# EasyEDA Pro project ProDocument_N64 SpyDVI QSB_2024-08-22.epro

# Schematic QSB
Board Name: N64 SpyDVI QSB; Create Date: 2024-08-20; Page Name: Schematic; Project Name: SpyDVI-QSB; Schematic Name: QSB; Update Date: 2024-08-22; Add into BOM: yes; Company: Chobrenga; Convert to PCB: yes; Date: 2024-08-22; Draw By: Chobrenga; REV: 1.1; Sheet: 1/1
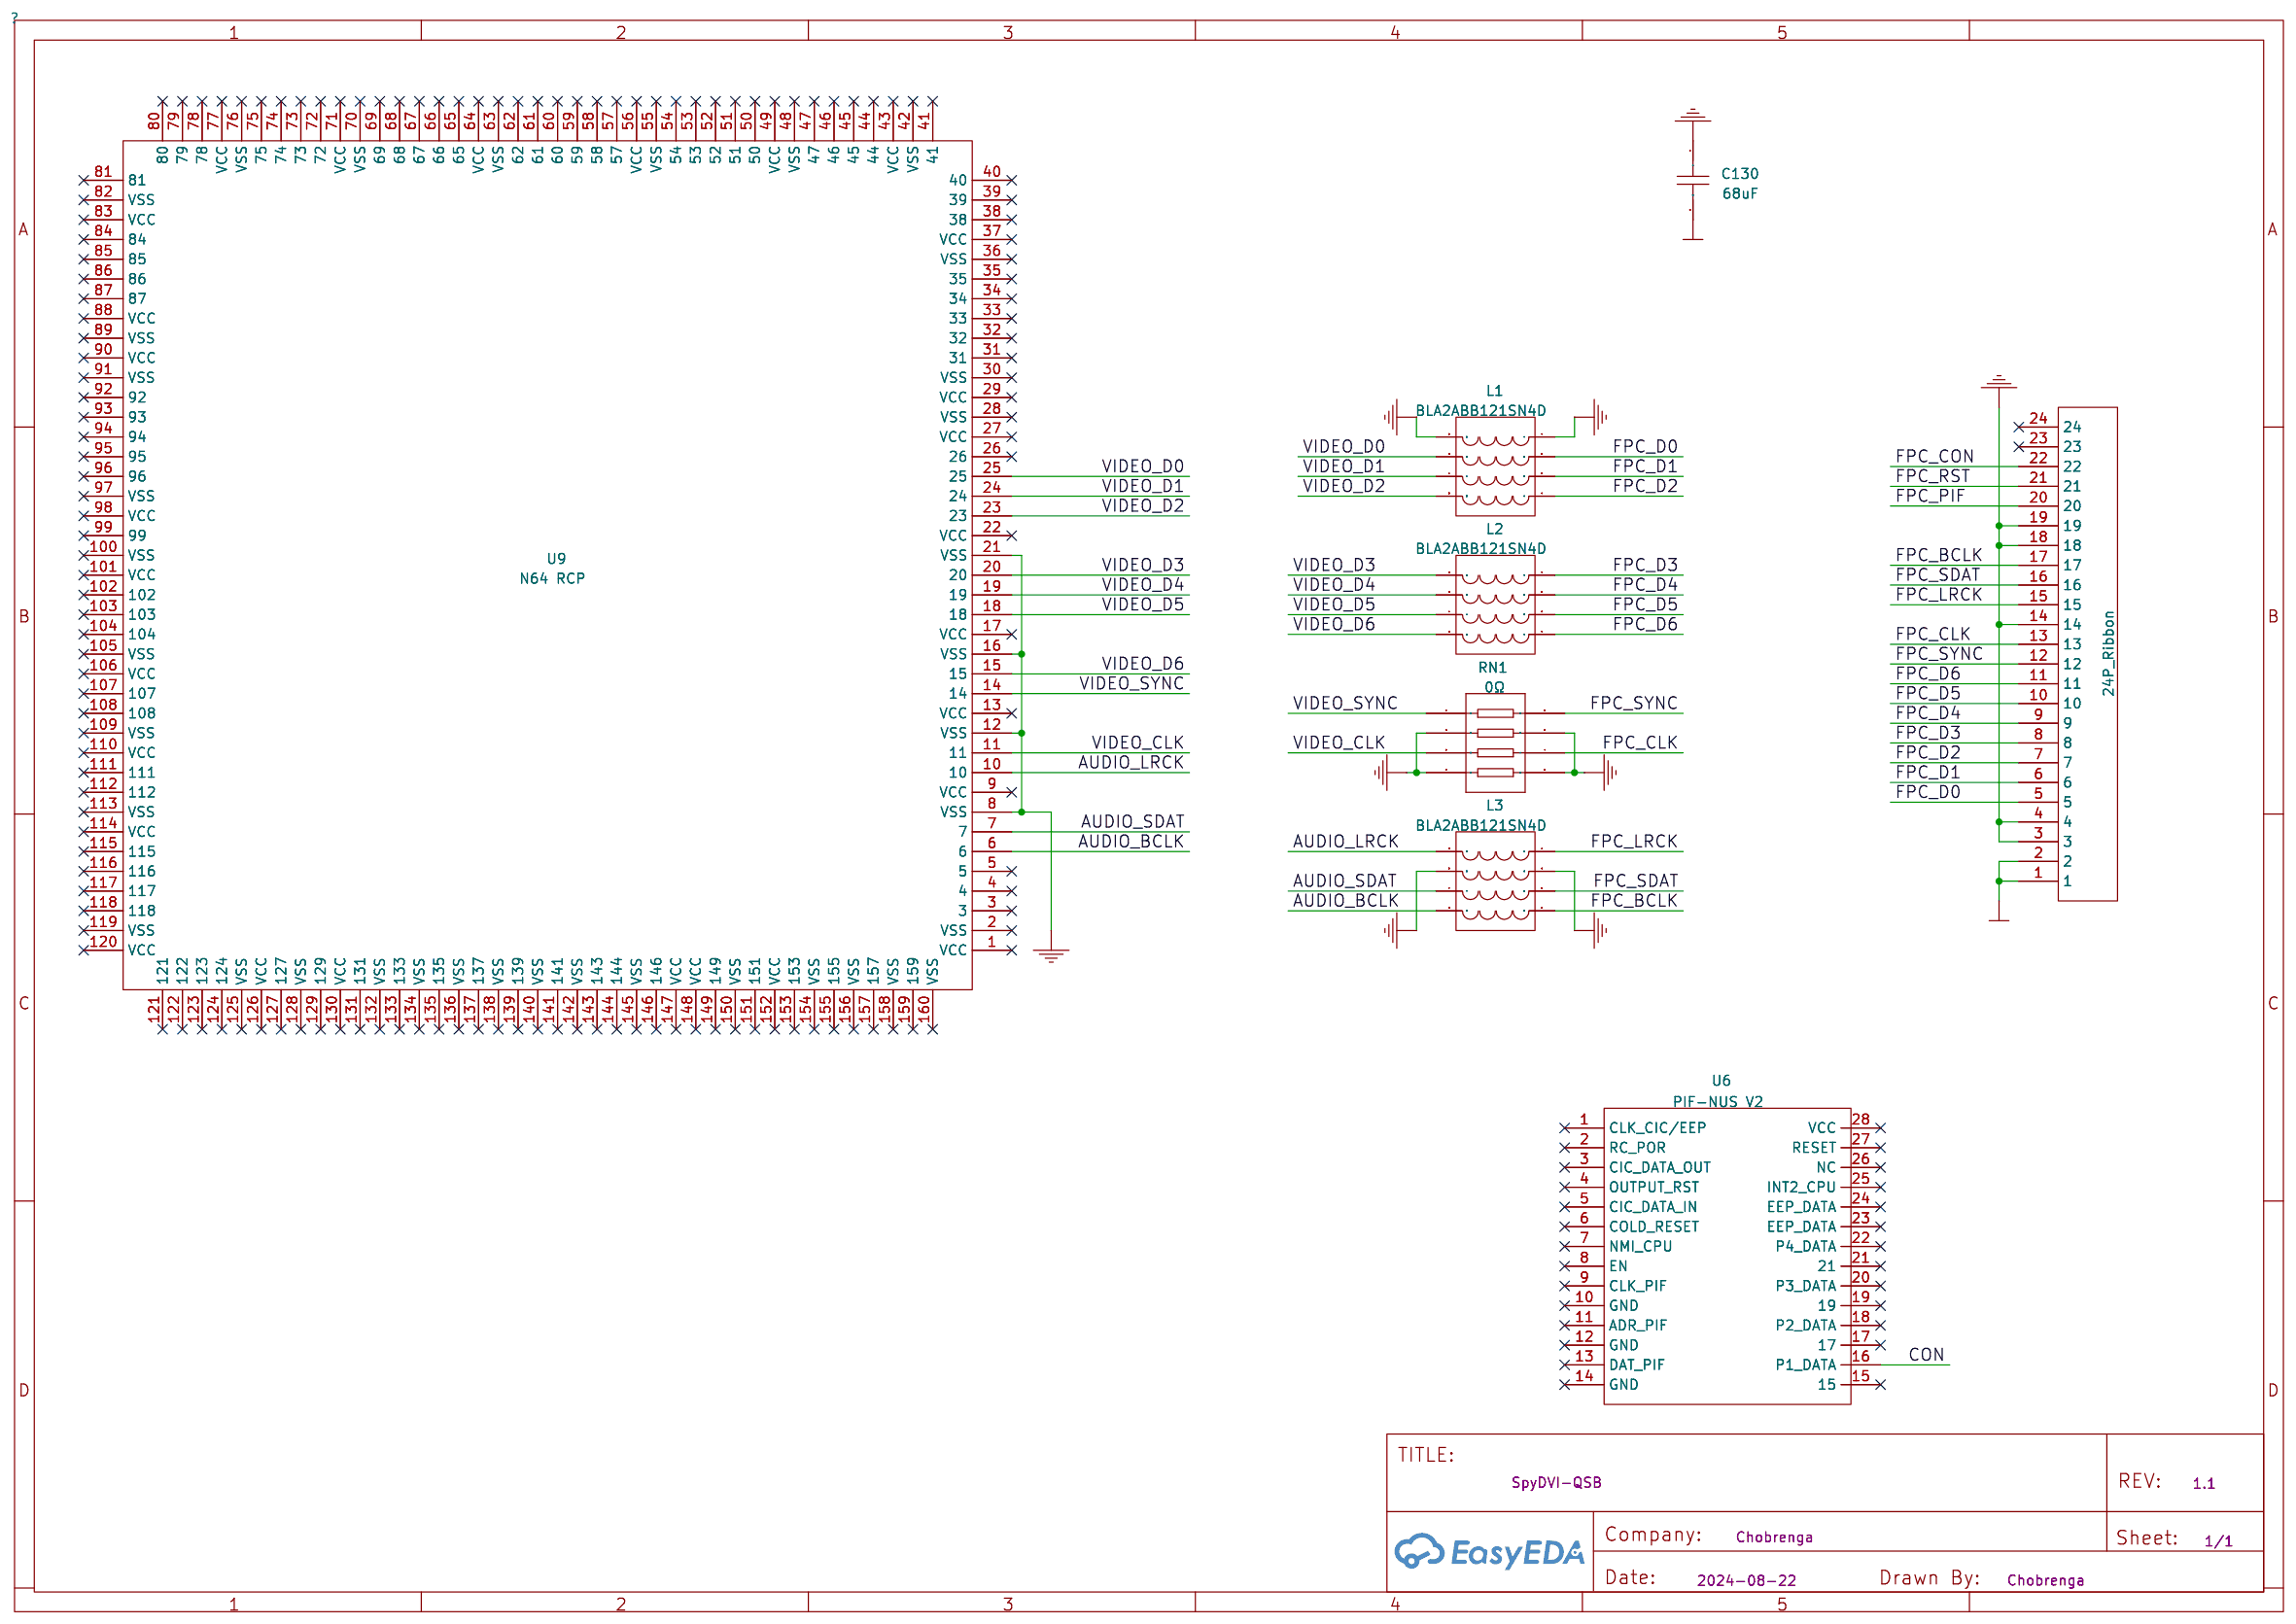
[diagram p0: schematic sheet]

## Parts
C130  68uF  (no BOM)
L1  BLA2ABB121SN4D  [BEAD-SMD_8P-L2.0-W1.0-P0.50-TL]
L2  BLA2ABB121SN4D  [BEAD-SMD_8P-L2.0-W1.0-P0.50-TL]
L3  BLA2ABB121SN4D  [BEAD-SMD_8P-L2.0-W1.0-P0.50-TL]
RN1  0Ω  [RES-ARRAY-SMD_0402-8P-L2.0-W1.0-BL]
U1  24P_Ribbon  [24P_FFC]  (no BOM)
U6  PIF-NUS V2  (no BOM)
U9  N64 RCP  [RCP NUS]  (no BOM)

## Library data of the parts
C130 = 68uF
L1-L3 = BLA2ABB121SN4D: Supplier: LCSC; Supplier Part: C440126; Manufacturer: muRata(村田); JLCPCB Part Class: Extended Part
RN1 = 0Ω: Supplier: LCSC; Manufacturer: FH(风华); Manufacturer Part: RC-MT08W000JT; Supplier Part: C2001; JLCPCB Part Class: Extended Part
U1 = 24P_Ribbon
U6 = PIF-NUS V2
U9 = N64 RCP

## Nets
+5V: C130.2 U1.1 U1.2
GND: C130.1 L1.4 L1.5 L3.3 L3.6 RN1.1 RN1.3 RN1.6 RN1.8 U1.3 U1.4 U1.14 U1.18 U1.19 U9.8(VSS) U9.12(VSS) U9.16(VSS) U9.21(VSS)
AUDIO_BCLK: L3.8 U9.6
AUDIO_LRCK: L3.5 U9.10
AUDIO_SDAT: L3.7 U9.7
CON: U6.16(P1 DATA)
FPC_BCLK: L3.1 U1.17
FPC_CLK: RN1.7 U1.13
FPC_CON: U1.22
FPC_D0: L1.3 U1.5
FPC_D1: L1.2 U1.6
FPC_D2: L1.1 U1.7
FPC_D3: L2.4 U1.8
FPC_D4: L2.3 U1.9
FPC_D5: L2.2 U1.10
FPC_D6: L2.1 U1.11
FPC_LRCK: L3.4 U1.15
FPC_PIF: U1.20
FPC_RST: U1.21
FPC_SDAT: L3.2 U1.16
FPC_SYNC: RN1.5 U1.12
VIDEO_CLK: RN1.2 U9.11
VIDEO_D0: L1.6 U9.25
VIDEO_D1: L1.7 U9.24
VIDEO_D2: L1.8 U9.23
VIDEO_D3: L2.5 U9.20
VIDEO_D4: L2.6 U9.19
VIDEO_D5: L2.7 U9.18
VIDEO_D6: L2.8 U9.15
VIDEO_SYNC: RN1.4 U9.14

Not connected (* = marked no-connect by the designer): U1 23* 24*; U6 1(CLK CIC/EEP)* 2(RC POR)* 3(CIC DATA OUT)* 4(OUTPUT RST)* 5(CIC DATA IN)* 6(COLD RESET)* 7(NMI_CPU)* 8(EN)* 9(CLK PIF)* 10(GND)* 11(ADR PIF)* 12(GND)* 13(DAT PIF)* 14(GND)* 15* 17* 18(P2 DATA)* 19* 20(P3 DATA)* 21* 22(P4 DATA)* 23(EEP DATA)* 24(EEP DATA)* 25(INT2 CPU)* 26(NC)* 27(RESET)* 28(VCC)*; U9 1(VCC)* 2(VSS)* 3* 4* 5* 9(VCC)* 13(VCC)* 17(VCC)* 22(VCC)* 26* 27(VCC)* 28(VSS)* 29(VCC)* 30(VSS)* 31* 32* 33* 34* 35* 36(VSS)* 37(VCC)* 38* 39* 40* 41* 42(VSS)* 43(VCC)* 44* 45* 46* 47* 48(VSS)* 49(VCC)* 50* 51* 52* 53* 54* 55(VSS)* 56(VCC)* 57* 58* 59* 60* 61* 62* 63(VSS)* 64(VCC)* 65* 66* 67* 68* 69* 70(VSS)* 71(VCC)* 72* 73* 74* 75* 76(VSS)* 77(VCC)* 78* 79* 80* 81* 82(VSS)* 83(VCC)* 84* 85* 86* 87* 88(VCC)* 89(VSS)* 90(VCC)* 91(VSS)* 92* 93* 94* 95* 96* 97(VSS)* 98(VCC)* 99* 100(VSS)* 101(VCC)* 102* 103* 104* 105(VSS)* 106(VCC)* 107* 108* 109(VSS)* 110(VCC)* 111* 112* 113(VSS)* 114(VCC)* 115* 116* 117* 118* 119(VSS)* 120(VCC)* 121* 122* 123* 124* 125(VSS)* 126(VCC)* 127* 128(VSS)* 129* 130(VCC)* 131* 132(VSS)* 133* 134(VSS)* 135* 136(VSS)* 137* 138(VSS)* 139* 140(VSS)* 141* 142(VSS)* 143* 144* 145(VSS)* 146* 147(VCC)* 148(VCC)* 149* 150(VSS)* 151* 152(VCC)* 153* 154(VSS)* 155* 156(VSS)* 157* 158(VSS)* 159* 160(VSS)*

# Board 1-PCB_PCB_N64 SpyDVI QSB
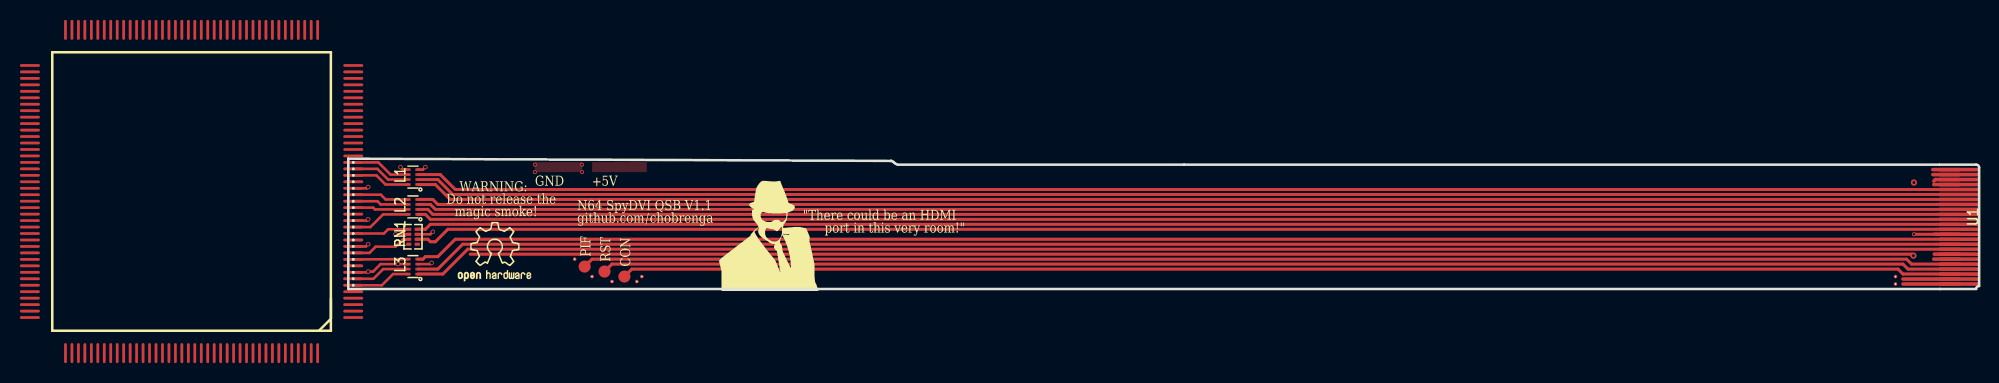
[diagram p1: board, top side]
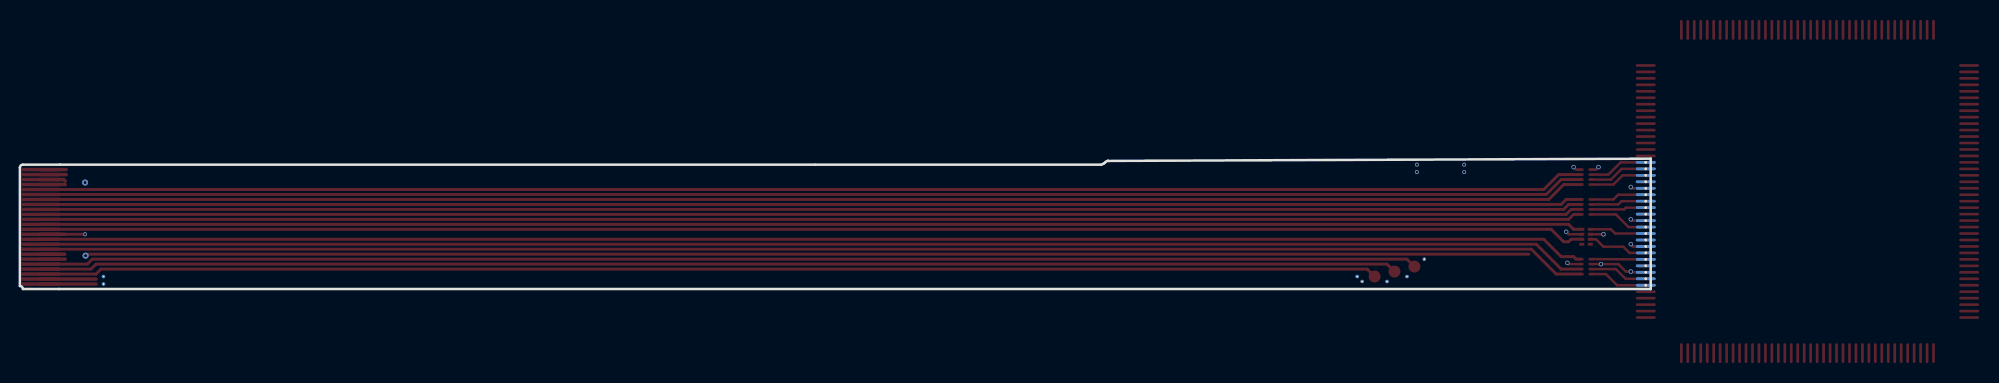
[diagram p2: board, bottom side, seen from below]

Outline 163.9 x 13.1 mm; copper layers: Top Layer, Bottom Layer. Coordinates in mm from the lower left corner of the outline.
Outline path: 159.9,12.5 84,12.5 55.24,12.5 arc(55.09,12.54) 54.96,12.62 54.84,12.72 arc(54.72,12.83) 54.56,12.88 54.55,12.88 0,13.1 0,0 160,0
Stack: Top Layer 0.012mm / Dielectric1 0.025mm FR4 er 4.5 / Bottom Layer 0.012mm

## Design rules (mm)
template: User Custom Config
spacing Default (default): track to track 0.13, other pairs 0 to 0.13
track width Default (default): min 0.254, default 0.254, max 25.4
differential pair differentialPair (default): width min 0.127, default 0.254, max 2.54; gap min 0.152, default 0.152
via Default (default): diameter min 0.35, default 0.35, max 100.025; hole min 0.15, default 0.15, max 59.995
pour e1 uses Default
pour e146 uses gge5972
pour e145 uses Default

## Placement (name value [footprint] x y rotation side)
L1  BLA2ABB121SN4D  [BEAD-SMD_8P-L2.0-W1.0-P0.50-TL]  6.5 11.25 90 top
L2  BLA2ABB121SN4D  [BEAD-SMD_8P-L2.0-W1.0-P0.50-TL]  6.5 8.25 90 top
L3  BLA2ABB121SN4D  [BEAD-SMD_8P-L2.0-W1.0-P0.50-TL]  6.5 2.25 90 top
NOREF  -  [Pad_e364]  155.5 0.5 0 top
NOREF#2  -  [Pad_e370]  22.75 3 0 top
NOREF#3  -  [Pad_e362]  155.5 1.25 0 top
NOREF#4  -  [Pad_e147]  23.75 2.25 0 top
NOREF#5  -  [Pad_e366]  29 0.75 0 top
NOREF#6  -  [Pad_e368]  26.5 0.75 0 top
NOREF#7  -  [Pad_e148]  27.75 1.25 0 top
NOREF#8  -  [Pad_e369]  24.5 1.25 0 top
NOREF#9  -  [Pad_e367]  29.5 1.25 0 top
NOREF#10  -  [Pad_e149]  25.75 1.75 0 top
RN1  0Ω  [RES-ARRAY-SMD_0402-8P-L2.0-W1.0-BL]  6.5 5.25 90 top
U1  24P_Ribbon  [24P_FFC]  161.9 6.25 270 top
U9  N64 RCP  [RCP NUS]  -15.75 9.8 0 top

## Footprints (pads in the part's own frame, mm; a bottom-side part is the same pattern mirrored in y, then rotated)
24P_FFC
  rect 0.35x4 smd: 1(-5.75,0) 2(-5.25,0) 3(-4.75,0) 4(-4.25,0) 5(-3.75,0) 6(-3.25,0) 7(-2.75,0) 8(-2.25,0) 9(-1.75,0) 10(-1.25,0) 11(-0.75,0) 12(-0.25,0) 13(0.25,0) 14(0.75,0) 15(1.25,0) 16(1.75,0) 17(2.25,0) 18(2.75,0) 19(3.25,0) 20(3.75,0) 21(4.25,0) 22(4.75,0) 23(5.25,0) 24(5.75,0)
BEAD-SMD_8P-L2.0-W1.0-P0.50-TL
  rect 0.25x0.5 smd: 1(-0.75,-0.5) 2(-0.25,-0.5) 3(0.25,-0.5) 4(0.75,-0.5) 5(0.75,0.5) 6(0.25,0.5) 7(-0.25,0.5) 8(-0.75,0.5)
Pad_e147
  round 1.2 smd: 1(0,0)
Pad_e148
  round 1.2 smd: 1(0,0)
Pad_e149
  round 1.2 smd: 1(0,0)
Pad_e362
  round 0.35 hole 0.15: 1(0,0)
Pad_e364
  round 0.35 hole 0.15: 1(0,0)
Pad_e366
  round 0.35 hole 0.15: 1(0,0)
Pad_e367
  round 0.35 hole 0.15: 1(0,0)
Pad_e368
  round 0.35 hole 0.15: 1(0,0)
Pad_e369
  round 0.35 hole 0.15: 1(0,0)
Pad_e370
  round 0.35 hole 0.15: 1(0,0)
RCP NUS
  oval 2x0.27 smd: 1(16.247,-12.673) 2(16.247,-12.024) 3(16.247,-11.373) 4(16.247,-10.723) 5(16.247,-10.073) 26(16.252,3.575) 27(16.252,4.224) 28(16.252,4.874) 29(16.253,5.524) 30(16.253,6.174) 31(16.253,6.824) 32(16.253,7.473) 33(16.253,8.123) 34(16.253,8.774) 35(16.253,9.424) 36(16.253,10.073) 37(16.253,10.723) 38(16.253,11.373) 39(16.253,12.023) 40(16.253,12.673) 81(-16.247,12.673) 82(-16.247,12.024) 83(-16.247,11.373) 84(-16.247,10.723) 85(-16.247,10.073) 86(-16.247,9.424) 87(-16.248,8.774) 88(-16.247,8.123) 89(-16.248,7.473) 90(-16.248,6.824) 91(-16.248,6.174) 92(-16.248,5.524) 93(-16.249,4.874) 94(-16.249,4.224) 95(-16.249,3.574) 96(-16.249,2.924) 97(-16.25,2.275) 98(-16.25,1.625) 99(-16.25,0.975) 100(-16.25,0.325) 101(-16.25,-0.325) 102(-16.251,-0.975) 103(-16.251,-1.625) 104(-16.251,-2.275) 105(-16.251,-2.925) 106(-16.251,-3.575) 107(-16.252,-4.224) 108(-16.252,-4.875) 109(-16.252,-5.524) 110(-16.252,-6.174) 111(-16.252,-6.824) 112(-16.252,-7.474) 113(-16.252,-8.124) 114(-16.252,-8.774) 115(-16.253,-9.424) 116(-16.253,-10.073) 117(-16.253,-10.723) 118(-16.253,-11.373) 119(-16.253,-12.023) 120(-16.253,-12.673)
  oval 2x0.27 hole 0.3: 6(16.247,-9.424) 7(16.248,-8.774) 8(16.247,-8.123) 9(16.248,-7.473) 10(16.248,-6.824) 11(16.248,-6.174) 12(16.248,-5.524) 13(16.249,-4.874) 14(16.25,-4.224) 15(16.25,-3.574) 16(16.25,-2.925) 17(16.25,-2.275) 18(16.25,-1.625) 19(16.25,-0.975) 20(16.25,-0.325) 21(16.25,0.325) 22(16.251,0.975) 23(16.252,1.625) 24(16.252,2.275) 25(16.252,2.925)
  oval 0.27x2 smd: 41(12.673,16.247) 42(12.024,16.247) 43(11.373,16.247) 44(10.723,16.247) 45(10.074,16.247) 46(9.424,16.247) 47(8.774,16.248) 48(8.123,16.247) 49(7.473,16.248) 50(6.824,16.248) 51(6.174,16.248) 52(5.524,16.248) 53(4.874,16.249) 54(4.224,16.249) 55(3.574,16.249) 56(2.925,16.25) 57(2.275,16.25) 58(1.625,16.25) 59(0.975,16.25) 60(0.325,16.25) 61(-0.325,16.25) 62(-0.975,16.251) 63(-1.625,16.251) 64(-2.275,16.251) 65(-2.925,16.251) 66(-3.575,16.251) 67(-4.224,16.252) 68(-4.874,16.252) 69(-5.524,16.252) 70(-6.174,16.252) 71(-6.824,16.252) 72(-7.474,16.252) 73(-8.123,16.252) 74(-8.774,16.252) 75(-9.423,16.253) 76(-10.073,16.253) 77(-10.723,16.253) 78(-11.373,16.253) 79(-12.023,16.253) 80(-12.673,16.253) 121(-12.673,-16.247) 122(-12.023,-16.247) 123(-11.373,-16.247) 124(-10.723,-16.247) 125(-10.073,-16.247) 126(-9.424,-16.247) 127(-8.774,-16.248) 128(-8.123,-16.247) 129(-7.473,-16.248) 130(-6.824,-16.248) 131(-6.174,-16.248) 132(-5.524,-16.248) 133(-4.874,-16.249) 134(-4.224,-16.249) 135(-3.574,-16.249) 136(-2.925,-16.25) 137(-2.275,-16.25) 138(-1.625,-16.25) 139(-0.975,-16.25) 140(-0.325,-16.25) 141(0.325,-16.25) 142(0.975,-16.252) 143(1.625,-16.252) 144(2.275,-16.252) 145(2.925,-16.252) 146(3.575,-16.252) 147(4.224,-16.252) 148(4.874,-16.253) 149(5.524,-16.253) 150(6.174,-16.253) 151(6.824,-16.253) 152(7.474,-16.253) 153(8.123,-16.253) 154(8.774,-16.253) 155(9.424,-16.253) 156(10.073,-16.253) 157(10.723,-16.253) 158(11.373,-16.253) 159(12.024,-16.253) 160(12.673,-16.253)
RES-ARRAY-SMD_0402-8P-L2.0-W1.0-BL
  rect 0.3x0.505 smd: 1(-0.75,0.427) 2(-0.25,0.427) 3(0.25,0.427) 4(0.75,0.427) 5(0.75,-0.427) 6(0.25,-0.427) 7(-0.25,-0.427) 8(-0.75,-0.427)

## Nets
As in the schematic, except:
GND: L1.4 L1.5 L3.3 L3.6 NOREF.1 NOREF#2.1 NOREF#3.1 NOREF#5.1 NOREF#6.1 NOREF#8.1 NOREF#9.1 RN1.1 RN1.3 RN1.6 RN1.8 U1.3 U1.4 U1.14 U1.18 U1.19 U9.8 U9.12 U9.16 U9.21
FPC_CON: NOREF#7.1 U1.22
FPC_PIF: NOREF#4.1 U1.20
FPC_RST: NOREF#10.1 U1.21

Pads without a net: U1 23 24; U9 1 2 3 4 5 9 13 17 22 26 27 28 29 30 31 32 33 34 35 36 37 38 39 40 41 42 43 44 45 46 47 48 49 50 51 52 53 54 55 56 57 58 59 60 61 62 63 64 65 66 67 68 69 70 71 72 73 74 75 76 77 78 79 80 81 82 83 84 85 86 87 88 89 90 91 92 93 94 95 96 97 98 99 100 101 102 103 104 105 106 107 108 109 110 111 112 113 114 115 116 117 118 119 120 121 122 123 124 125 126 127 128 129 130 131 132 133 134 135 136 137 138 139 140 141 142 143 144 145 146 147 148 149 150 151 152 153 154 155 156 157 158 159 160

## Via types
v1: diameter 0.4, hole 0.25, Top Layer to Bottom Layer, 5 vias
v2: diameter 0.45, hole 0.31, Top Layer to Bottom Layer, 10 vias
v3: diameter 0.62, hole 0.31, Top Layer to Bottom Layer, 2 vias

## Routing (per net, layer and track width the routed paths; a pad name or vN(x,y) marks a point on that pad's centre or on a via; arc(x,y) is an arc through that point)
+5V: length 5.3
  Top Layer w0.35: U1.1 159.25,12 ; U1.2 159.25,11.5
GND: length 176.9
  Top Layer w0.254: v2(5.25,12.25) 5.5,12 L1.5 ; 8.5,5.75 8.25,5.5 6.93,5.5 ; L3.6 3.25,2.5 2.5,1.75 2,1.75 1.93,1.68 U9.8 ; v2(7.75,12.25) 7.5,12 L1.4 ; U9.12 1.78,4.28 v2(2,4.5) ; U9.16 1.88,6.88 v2(2,7) ; v2(2,10.25) 1.87,10.13 0.5,10.13 ; 8.37,2.63 8.25,2.5 L3.3 ; RN1.3 v2(4.75,5.5)
  Top Layer w0.3: v3(157.3,3.35) 157.15,3.5 12.25,3.5 ; v1(157.35,5.5) 159.79,5.5
  Top Layer w0.35: U1.18 159.4,3.5 ; U1.3 159.5,11 159.35,10.85 ; U1.4 159.35,10.5 ; U1.14 159.4,5.5 ; U1.19 159.35,3
  vias: v1(18.75,12.5) v1(18.75,11.75) v1(23.5,12.5) v1(23.5,11.75) v2(2,1.75) v2(5,2.5) v2(8.38,2.63) v2(8.5,5.75) v3(157.35,10.7)
AUDIO_BCLK: length 6
  Top Layer w0.254: U9.6 3.38,0.38 4.5,1.5 L3.8
AUDIO_LRCK: length 5.5
  Top Layer w0.254: U9.10 L3.5
AUDIO_SDAT: length 5.9
  Top Layer w0.254: L3.7 3.5,2 2.53,1.03 0.5,1.03
FPC_BCLK: length 155.9
  Top Layer w0.3: U1.17 12,4 9.5,1.5 L3.1
FPC_CLK: length 155.6
  Top Layer w0.3: 6.93,5 8,5 8.25,4.75 8.75,4.75 10,6 U1.13
FPC_CON: length 134.7
  Top Layer w0.3: U1.22 156.25,1.5 155.75,2 28.5,2 NOREF#7.1
FPC_D0: length 155.5
  Top Layer w0.3: L1.3 9.25,11.5 10.75,10 U1.5
FPC_D1: length 155.5
  Top Layer w0.3: L1.2 9,11 10.5,9.5 U1.6
FPC_D2: length 155.5
  Top Layer w0.3: L1.1 8.75,10.5 10.25,9 U1.7
FPC_D3: length 155.1
  Top Layer w0.3: U1.8 9,8.5 8.5,9 L2.4
FPC_D4: length 155.1
  Top Layer w0.3: U1.9 8.75,8 8.25,8.5 L2.3
FPC_D5: length 155.1
  Top Layer w0.3: L2.2 8,8 8.5,7.5 U1.10
FPC_D6: length 155.1
  Top Layer w0.3: U1.11 8.25,7 7.75,7.5 L2.1
FPC_LRCK: length 155.7
  Top Layer w0.3: L3.4 7.5,3 7.75,3.25 9,3.25 10.75,5 U1.15
FPC_PIF: length 138.7
  Top Layer w0.3: NOREF#4.1 24.5,3 156.61,3 157.11,2.5 U1.20
FPC_RST: length 136.7
  Top Layer w0.3: U1.21 156.75,2 156.25,2.5 26.5,2.5 25.75,1.75
FPC_SDAT: length 155.9
  Top Layer w0.3: L3.2 9,2 11.5,4.5 U1.16
FPC_SYNC: length 155.2
  Top Layer w0.3: RN1.5 7.75,6 8.25,6.5 U1.12
VIDEO_CLK: length 6.1
  Top Layer w0.254: U9.11 2.13,3.63 2.75,4.25 4.75,4.25 5.5,5 RN1.2
VIDEO_D0: length 6
  Top Layer w0.254: 0.5,12.73 3.03,12.73 4.25,11.5 L1.6
VIDEO_D1: length 5.9
  Top Layer w0.254: 0.5,12.08 2.93,12.08 4,11 L1.7
VIDEO_D2: length 5.9
  Top Layer w0.254: L1.8 3.75,10.5 2.82,11.43 0.5,11.43
VIDEO_D3: length 5.7
  Top Layer w0.254: U9.20 3.27,9.48 3.75,9 L2.5
VIDEO_D4: length 5.6
  Top Layer w0.254: 0.5,8.83 2.93,8.83 3.25,8.5 L2.6
VIDEO_D5: length 5.6
  Top Layer w0.254: L2.7 2.67,8 2.5,8.18 U9.18
VIDEO_D6: length 6
  Top Layer w0.254: 0.5,6.23 2.22,6.23 3.5,7.5 L2.8
VIDEO_SYNC: length 5.7
  Top Layer w0.254: U9.14 3.58,5.58 4,6 RN1.4

## Copper pours and planes (outline as drawn; the poured copper is in the pictures)
+5V on Top Layer: 159.5,12.5 159.5,11.25 55,11.25 54,11.75 24.5,11.75 24.5,13.25 4.5,13.25 4.5,15.5 24.5,15.5
+5V on Top Layer: 24.5,12.75 30,12.75 30,11.75 24.5,11.75
GND on Top Layer: -0.62,16.13 -0.75,-3.25 159.5,-3.25 159.5,13
GND on Top Layer: 18.75,12.75 23.5,12.75 23.5,11.75 18.75,11.75
GND on Bottom Layer: -1,17 -1,-1.25 0,-2.25 159.5,-0.5 159.5,13

Small or netless copper shapes (teardrops, artwork), in the pictures only: 56 on Top Layer

## Text on the board
Top Silkscreen Layer: N64 SpyDVI QSB V1.1 | github.com/chobrenga | "There could be an HDMI | port in this very room!" | PIF | RST | CON | Do not release the | magic smoke! | WARNING: | GND | +5V
